# EAGLE schematic Op-amp Microphone Preamp (EAGLE 6.2)
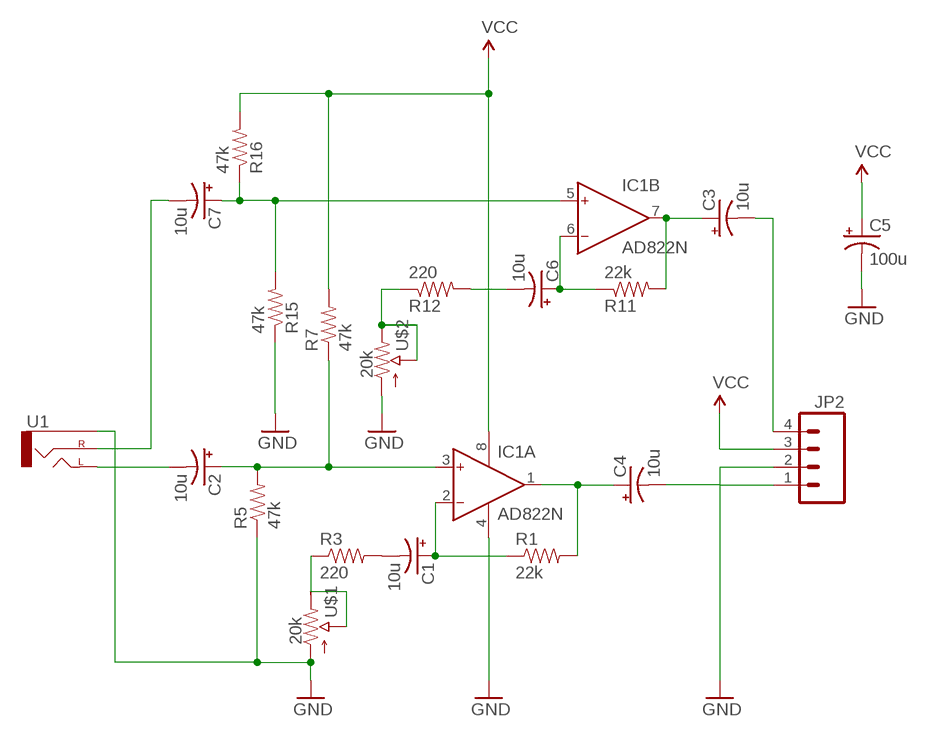
[diagram p0: schematic, sheet 1]

## Parts
C1  10u  CAP_POLPTH1  [CPOL-RADIAL-100UF-25V]
C2  10u  CAP_POLPTH1  [CPOL-RADIAL-100UF-25V]
C3  10u  CAP_POLPTH1  [CPOL-RADIAL-100UF-25V]
C4  10u  CAP_POLPTH1  [CPOL-RADIAL-100UF-25V]
C5  100u  CAP_POLPTH1  [CPOL-RADIAL-100UF-25V]
C6  10u  CAP_POLPTH1  [CPOL-RADIAL-100UF-25V]
C7  10u  CAP_POLPTH1  [CPOL-RADIAL-100UF-25V]
IC1  AD822N  [DIL08]
JP2  M04POLAR  [MOLEX-1X4]
R1  22k  RESISTORPTH-1/6W  [1/6W-RES]
R3  220  RESISTORPTH-1/4W  [AXIAL-0.4]
R5  47k  RESISTORPTH-1/4W  [AXIAL-0.4]
R7  47k  RESISTORPTH-1/4W  [AXIAL-0.4]
R11  22k  RESISTORPTH-1/6W  [1/6W-RES]
R12  220  RESISTORPTH-1/4W  [AXIAL-0.4]
R15  47k  RESISTORPTH-1/4W  [AXIAL-0.4]
R16  47k  RESISTORPTH-1/4W  [AXIAL-0.4]
U1  AUDIO-JACKPTH  [AUDIO-JACK]
U$1  20k  POT100K_3362U  [3362U]
U$2  20k  POT100K_3362U  [3362U]

## Nets
GND: C5.2(-) IC1.4(P:V-) JP2.2 R5.P$1 R15.P$1 U1.SLEEVE U$1.P$3(A) U$2.P$3(A)
N$1: R3.P$1 U$1.P$1(E) U$1.P$2(S)
N$2: C1.2(-) R3.P$2
N$3: C4.1(+) IC1.1(A:OUT) R1.2
N$4: C3.2(-) JP2.4
N$5: C1.1(+) IC1.2(A:IN-) R1.1
N$6: C2.1(+) IC1.3(A:IN+) R5.P$2 R7.P$1
N$7: C7.1(+) IC1.5(B:IN+) R15.P$2 R16.P$1
N$8: C2.2(-) U1.TIP(LEFT)
N$9: C7.2(-) U1.RING(RIGHT)
N$10: R12.P$1 U$2.P$1(E) U$2.P$2(S)
N$11: C6.2(-) R12.P$2
N$12: C6.1(+) IC1.6(B:IN-) R11.1
N$13: C4.2(-) JP2.1
N$14: C3.1(+) IC1.7(B:OUT) R11.2
VCC: C5.1(+) IC1.8(P:V+) JP2.3 R7.P$2 R16.P$2

## Library data of the parts
C1-C7 = SparkFun:CAP_POL: Capacitor Polarized These are standard SMD and PTH capacitors. Normally 10uF, 47uF, and 100uF in electrolytic and tantalum varieties. Always verify the external diameter of the through hole cap, it varies with capacity, voltage, and manufacturer. The EIA devices should be standard.
IC1 = analog-devices:AD822: Single-Supply, Rail-to-Rail Low Power FET-Input Op Amp Source: http://www.analog.com/static/imported-files/data_sheets/AD822.pdf; OC_FARNELL: 1438581; OC_NEWARK: unknown
JP2 = SparkFun:M04: Header 4 Standard 4-pin 0.1" header. Use with straight break away headers (SKU : PRT-00116), right angle break away headers (PRT-00553), swiss pins (PRT-00743), machine pins (PRT-00117), and female headers (PRT-00115). Molex polarized connector foot print use with SKU : PRT-08231 with associated crimp pins and housings. 1MM SMD Version SKU: PRT-10208
R1 = My Library:RESISTOR: Resistor Basic schematic elements and footprints for 0603, 1206, and PTH resistors.
R3 R5 R7 R11 R12 R15 R16 = SparkFun:RESISTOR: Resistor Basic schematic elements and footprints for 0603, 1206, and PTH resistors.
U1 = SparkFun:AUDIO-JACK: 3.5mm Audio Jack Simple 3.5mm common PCB mount audio jack. SKU: PRT-08032
U$1 U$2 = My Library:POT